# Altium schematic sheet Audio output Codec.SchDoc
size Letter
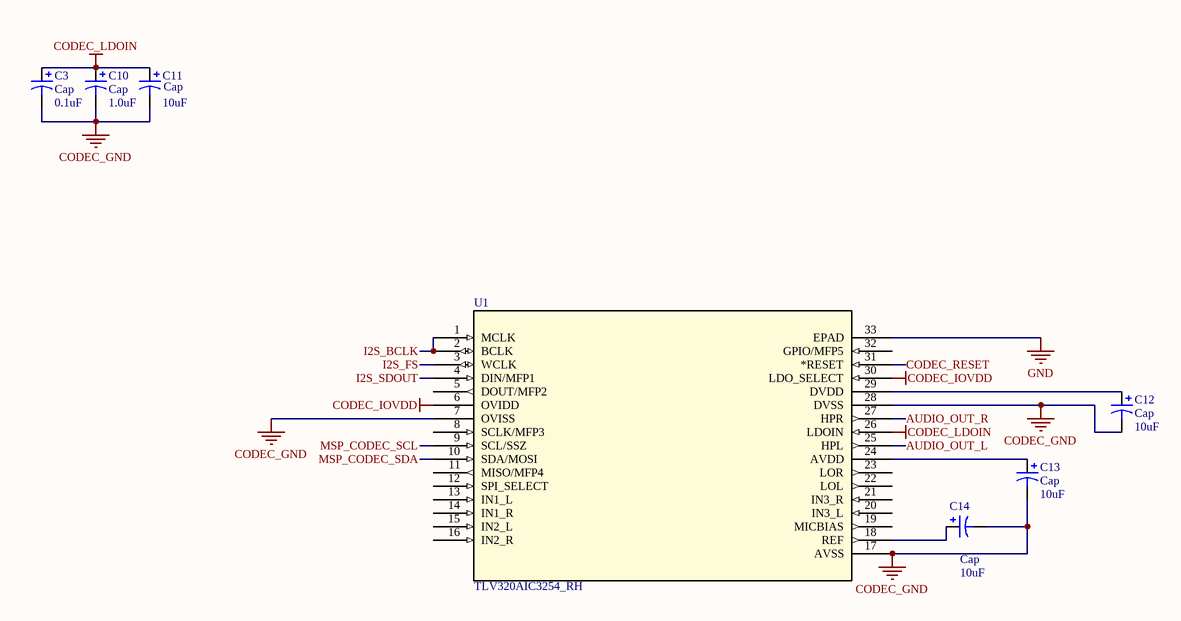
[diagram p0: Audio output Codec.SchDoc]

## Parts
C3  Cap  value 0.1uF  [C0805]
C10  Cap  value 1.0uF  [C0805]
C11  Cap  value 10uF  [C0805]
C12  Cap  value 10uF  [C0805]
C13  Cap  value 10uF  [C0805]
C14  Cap  value 10uF  [C0805]
U1  TLV320AIC3254_RH  [RHB32_3P45X3P45]

## Nets
CODEC_GND: C3.2 C10.2 C11.2 C12.2 C13.2 C14.2 U1.7(OVISS) U1.17(AVSS) U1.28(DVSS)
CODEC_IOVDD: U1.6(OVIDD) U1.30(LDO_SELECT)
CODEC_LDOIN: C3.1 C10.1 C11.1 U1.26(LDOIN)
GND: U1.33(EPAD)
AUDIO_OUT_L: U1.25(HPL)
AUDIO_OUT_R: U1.27(HPR)
CODEC_RESET: U1.31(*RESET)
I2S_BCLK: U1.1(MCLK) U1.2(BCLK)
I2S_FS: U1.3(WCLK)
I2S_SDOUT: U1.4(DIN/MFP1)
MSP_CODEC_SCL: U1.9(SCL/SSZ)
MSP_CODEC_SDA: U1.10(SDA/MOSI)
NetC12_1: C12.1 U1.29(DVDD)
NetC13_1: C13.1 U1.24(AVDD)
NetC14_1: C14.1 U1.18(REF)

Not connected (* = marked no-connect by the designer): U1 5(DOUT/MFP2) 8(SCLK/MFP3) 11(MISO/MFP4) 12(SPI_SELECT) 13(IN1_L) 14(IN1_R) 15(IN2_L) 16(IN2_R) 19(MICBIAS) 20(IN3_L) 21(IN3_R) 22(LOL) 23(LOR) 32(GPIO/MFP5)

## Library data of the parts
C3 C10-C14 = Cap Pol3: Polarized Capacitor (Surface Mount); Published: 8-Jun-2000; LatestRevisionDate: 29-May-2009; LatestRevisionNote: IPC-7351 Footprint Added.; PackageReference: C0805; Publisher: Altium Limited; PackageDescription: Chip Capacitor
U1 = TLV320AIC3254_RH: Imported; Manufacturer_Part_Number: tlv320aic3254_rhb_32; Vendor: Texas Instruments; PACKAGE_DESIGNATOR: RHB; PIN_COUNT: 32; FAMILY_NAME: Audio CODEC; INDUSTRY_STD_PKG_TYPE: QFN; GENERIC_PART_NUMBER: TLV320AIC3254; Manufacturer: Texas Instruments; Datasheet_URL: http://www.ti.com/lit/gpn/TLV320AIC3254; Value: Value; Type: Type; RefDes: RefDes